# Altium schematic sheet SPI.SchDoc
size A4; SheetNumber: 3; SheetTotal: 8
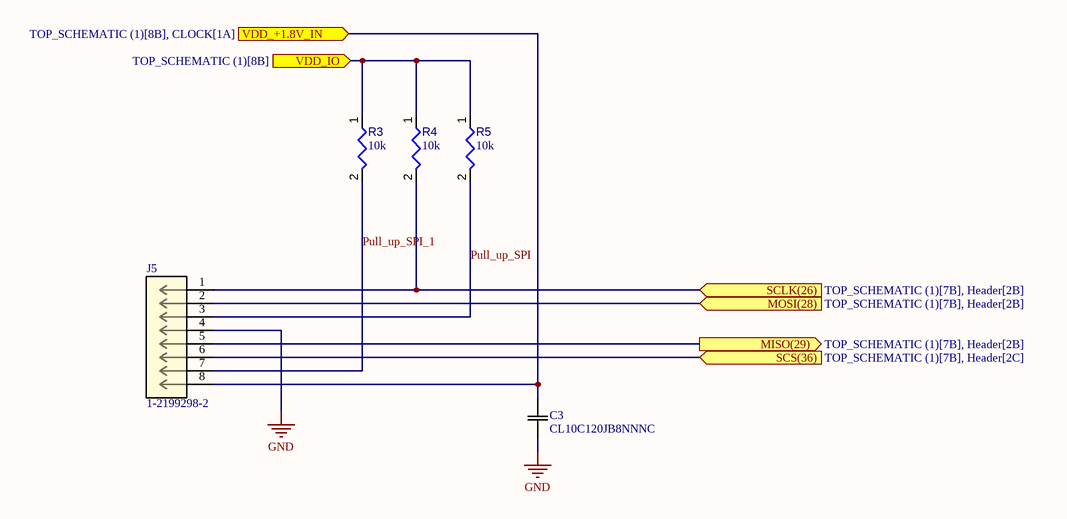
[diagram p0: SPI.SchDoc]

## Parts
C3  CL10C120JB8NNNC  [CAP_CL10_SAM]
J5  1-2199298-2  [CONN8_1-2199298-2_TEC]
R3  value 10k  [RESC2013X50X35ML15T15]  (hidden comment: Resistor 10k +/-1% 0805 125 mW)
R4  value 10k  [RESC2013X50X35ML15T15]  (hidden comment: Resistor 10k +/-1% 0805 125 mW)
R5  value 10k  [RESC2013X50X35ML15T15]  (hidden comment: Resistor 10k +/-1% 0805 125 mW)

## Ports
MISO(29) (out, see TOP_SCHEMATIC (1)[7B], Header[2B]), MOSI(28) (in, see TOP_SCHEMATIC (1)[7B], Header[2B]), SCLK(26) (in, see TOP_SCHEMATIC (1)[7B], Header[2B]), SCS(36) (in, see TOP_SCHEMATIC (1)[7B], Header[2C]), VDD_+1.8V_IN (in, see TOP_SCHEMATIC (1)[8B], CLOCK[1A]), VDD_IO (in, see TOP_SCHEMATIC (1)[8B])

## Nets
GND: C3.1 J5.4
MISO(29): J5.5 ; port MISO(29)
MOSI(28): J5.2 ; port MOSI(28)
Pull_up_SPI: J5.3 R5.2
Pull_up_SPI_1: J5.7 R3.2
SCLK(26): J5.1 R4.2 ; port SCLK(26)
SCS(36): J5.6 ; port SCS(36)
VDD_+1.8V_IN: C3.2 J5.8 ; port VDD_+1.8V_IN
VDD_IO: R3.1 R4.1 R5.1 ; port VDD_IO

## Library data of the parts
C3 = CL10C120JB8NNNC: No Description Available; Manufacturer_Name: Samsung; Copyright: Copyright (C) 2026 Ultra Librarian. All rights reserved.; Manufacturer_Part_Number: CL10C120JB8NNNC
J5 = 1-2199298-2: 8P,DIP SKT,300 CL,LDR,PB FREE; Manufacturer_Name: TE Connectivity; TYPE: DIP; Copyright: Copyright (C) 2026 Ultra Librarian. All rights reserved.; Manufacturer_Part_Number: 1-2199298-2; RefDes: RefDes
R3-R5 = CMP-009-00018-5: Chip Resistor, 10 KOhm, +/- 1%, 125 mW, -55 to 155 degC, 0805 (2012 Metric); Power: 125mW; Voltage Rating: 150V; Tolerance: 1%; Pins: 2; Min Operating Temperature: -55°C; Case/Package: 0805; Max Operating Temperature: 155°C; RoHS Compliant: True; Mounting Technology: SM